# Altium schematic sheet GZ7_1_x-REMOT.SchDoc: GZ8-4-0
size B; SheetNumber: 6; SheetTotal: 9
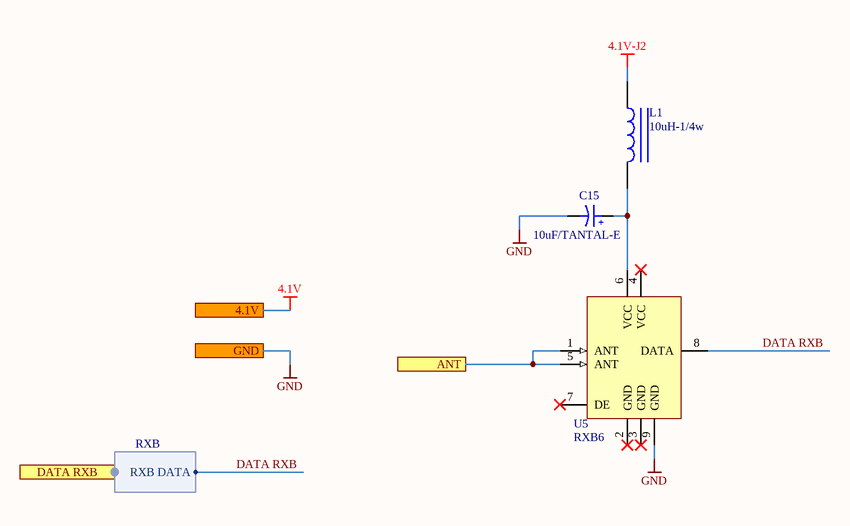
[diagram p0: GZ7_1_x-REMOT.SchDoc]

## Parts
C15  10uF/TANTAL-E  [C_TN_3528]
L1  10uH-1/4w  [Resistor_0.25w-0.4]
U5  RXB6  [RXB_6]

## Ports
4.1V, ANT, DATA RXB (harness RXB), GND

## Harnesses
RXB: RXB DATA

## Nets
4.1V: port 4.1V
4.1V-J2: L1.1
GND: C15.2 U5.9(GND) ; port GND
ANT: U5.1(ANT) U5.5(ANT) ; port ANT
DATA RXB: U5.8(DATA) ; port DATA RXB.RXB DATA
NetC15_1: C15.1 L1.2 U5.6(VCC)

Not connected (* = marked no-connect by the designer): U5 2(GND)* 3(GND)* 4(VCC)* 7(DE)*

## Notes on the sheet
- Serial Number:
- Altium Vip Course
- Title:
- Revision:
- Approved By:
- Date:
- Sheet       of
- SheetTotal
- Sheet Size: B
- File:
- (in symbol Cap electrolitic radial 10x21) +

## Library data of the parts
C15 = Cap electrolitic radial 10x21: Cap electrolitic radial; Part. No: 100U/50V; Designer: Abbas Basereh; Data: 16-12-2016
L1 = INDUCTOR IRON: INDUCTOR 1/4w